# Altium project RemoteController.PrjPcb
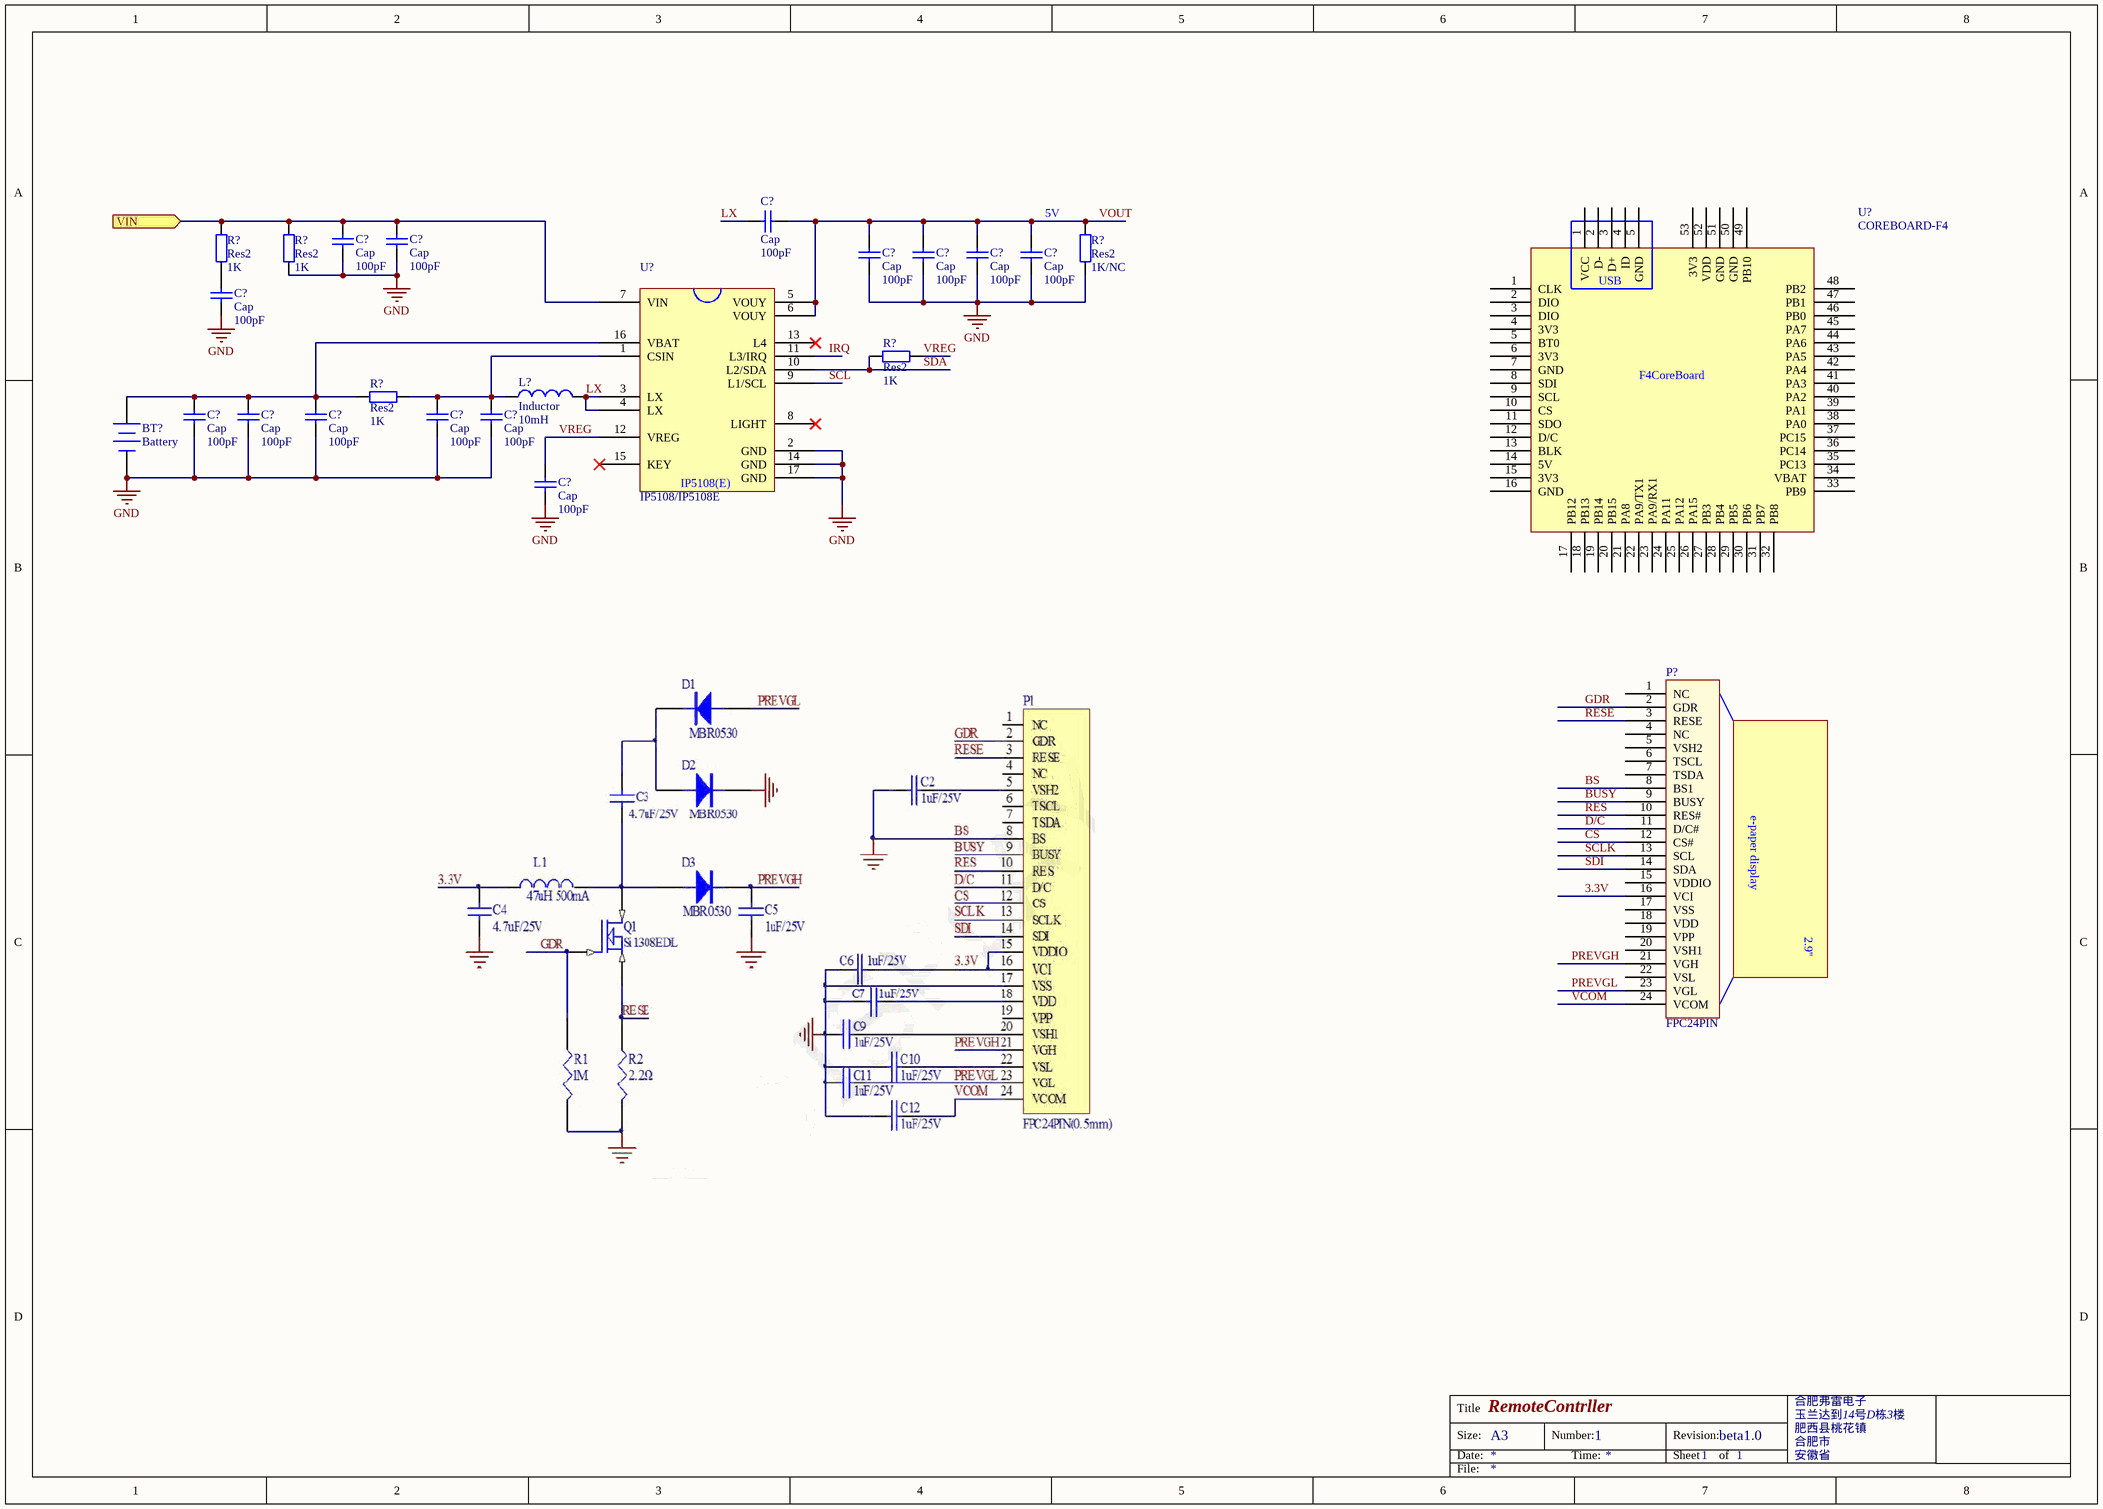
[diagram p0: RemoteController.SchDoc]
1 sheet, 24 parts. Net scope: flat (ports and power ports of the same name join across sheets).

## Sheet RemoteController.SchDoc: RemoteContrller
size A3; Organization: 合肥弗雷电子; Address1: 玉兰达到14号D栋3楼; Address2: 肥西县桃花镇; Address3: 合肥市; Address4: 安徽省; DocumentNumber: 1; Revision: beta1.0; SheetNumber: 1; SheetTotal: 1

### Parts
(Parts that share a designator on the sheet are numbered #1, #2 ... from top to bottom, then left to right.)
BT?  Battery  [BAT-2]
C?#1  Cap  value 100pF  [RAD-0.3]
C?#2  Cap  value 100pF  [RAD-0.3]
C?#3  Cap  value 100pF  [RAD-0.3]
C?#4  Cap  value 100pF  [RAD-0.3]
C?#5  Cap  value 100pF  [RAD-0.3]
C?#6  Cap  value 100pF  [RAD-0.3]
C?#7  Cap  value 100pF  [RAD-0.3]
C?#8  Cap  value 100pF  [RAD-0.3]
C?#9  Cap  value 100pF  [RAD-0.3]
C?#10  Cap  value 100pF  [RAD-0.3]
C?#11  Cap  value 100pF  [RAD-0.3]
C?#12  Cap  value 100pF  [RAD-0.3]
C?#13  Cap  value 100pF  [RAD-0.3]
C?#14  Cap  value 100pF  [RAD-0.3]
L?  Inductor  value 10mH  [0402-A]
P?  FPC24PIN
R?#1  Res2  value 1K  [AXIAL-0.4]
R?#2  Res2  value 1K  [AXIAL-0.4]
R?#3  Res2  value 1K/NC  [AXIAL-0.4]
R?#4  Res2  value 1K  [AXIAL-0.4]
R?#5  Res2  value 1K  [AXIAL-0.4]
U?#1  IP5108/IP5108E
U?#2  COREBOARD-F4

### Ports
VIN (in)

### Nets
GND: BT?.2(-) C?#2.1 C?#3.1 C?#4.1 C?#5.1 C?#6.1 C?#7.1 C?#8.1 C?#9.1 C?#10.1 C?#11.1 C?#12.1 C?#13.1 C?#14.1 R?#2.1 R?#3.1 U?#1.2(GND) U?#1.14(GND) U?#1.17(GND)
3.3V: P?.16(VCI)
BS: P?.8(BS1)
BUSY: P?.9(BUSY)
CS: P?.12(CS#)
D/C: P?.11(D/C#)
GDR: P?.2(GDR)
IRQ: U?#1.11(L3/IRQ)
LX: C?#1.2 L?.2 U?#1.3(LX) U?#1.4(LX)
PREVGH: P?.21(VGH)
PREVGL: P?.23(VGL)
RES: P?.10(RES#)
RESE: P?.3(RESE)
SCL: U?#1.9(L1/SCL)
SCLK: P?.13(SCL)
SDA: R?#4.1 U?#1.10(L2/SDA)
SDI: P?.14(SDA)
VCOM: P?.24(VCOM)
VOUT: C?#1.1 C?#4.2 C?#5.2 C?#6.2 C?#7.2 R?#3.2 U?#1.5(VOUY) U?#1.6(VOUY)
VREG: C?#14.2 R?#4.2 U?#1.12(VREG)
NetBT?_1: BT?.1(+) C?#9.2 C?#10.2 C?#11.2 R?#5.2 U?#1.16(VBAT)
NetC?#2_2: C?#2.2 C?#3.2 R?#1.2 R?#2.2 U?#1.7(VIN) ; port VIN
NetC?#8_2: C?#8.2 R?#1.1
NetC?#12_2: C?#12.2 C?#13.2 L?.1 R?#5.1 U?#1.1(CSIN)

Not connected (* = marked no-connect by the designer): P? 1(NC) 4(NC) 5(VSH2) 6(TSCL) 7(TSDA) 15(VDDIO) 17(VSS) 18(VDD) 19(VPP) 20(VSH1) 22(VSL); U?#1 8(LIGHT)* 13(L4)* 15(KEY)*; U?#2 1(CLK) 2(DIO) 3(DIO) 4(3V3) 5(BT0) 6(3V3) 7(GND) 8(SDI) 9(SCL) 10(CS) 11(SDO) 12(D/C) 13(BLK) 14(5V) 15(3V3) 16(GND) 17(PB12) 18(PB13) 19(PB14) 20(PB15) 21(PA8) 22(PA9/TX1) 23(PA9/RX1) 24(PA11) 25(PA12) 26(PA15) 27(PB3) 28(PB4) 29(PB5) 30(PB6) 31(PB7) 32(PB8) 33(PB9) 34(VBAT) 35(PC13) 36(PC14) 37(PC15) 38(PA0) 39(PA1) 40(PA2) 41(PA3) 42(PA4) 43(PA5) 44(PA6) 45(PA7) 46(PB0) 47(PB1) 48(PB2) 49(PB10) 50(GND) 51(GND) 52(VDD) 53(3V3)

### Notes on the sheet
- 5V
- Title
- Size:
- Date:
- A3
- Number:
- Time:
- Revision:
- Sheet
- of
- File:
- (in symbol COREBOARD-F4) USB; F4CoreBoard
- (in symbol FPC24PIN) e-paper display; 2.9''
- (in symbol IP5108/IP5108E) IP5108(E)

### Library data of the parts
BT? = Battery: Multicell Battery; Published: 24-Mar-1999; LatestRevisionDate: 17-Jul-2002; LatestRevisionNote: Re-released for DXP Platform.; PackageReference: BAT-2; Publisher: Altium Limited; PackageDescription: Battery; 2 Leads
C?#1-C?#14 = Cap: Capacitor; Published: 8-Jun-2000; LatestRevisionDate: 17-Jul-2002; LatestRevisionNote: Re-released for DXP Platform.; PackageReference: RAD-0.3; Publisher: Altium Limited; PackageDescription: Radial Cap, Thru-Hole; 2 Leads; 0.3 in Pin Spacing
L? = Inductor: Code_IEC: 1005; Published: 8-Jun-2000; LatestRevisionDate: 29-May-2009; LatestRevisionNote: IPC-7351 Footprint Added.; PackageReference: 0402-A; Publisher: Altium Limited; PackageDescription: Chip Inductor; Code_JEITA: 0402
R?#1-R?#5 = Res2: Resistor; Published: 8-Jun-2000; LatestRevisionDate: 17-Jul-2002; LatestRevisionNote: Re-released for DXP Platform.; PackageReference: AXIAL-0.4; Publisher: Altium Limited; PackageDescription: Axial Device, Thru-Hole; 2 Leads; 0.4 in Pin Spacing